# Altium schematic sheet Analog.SchDoc
size A4; SheetNumber: 3; SheetTotal: 3
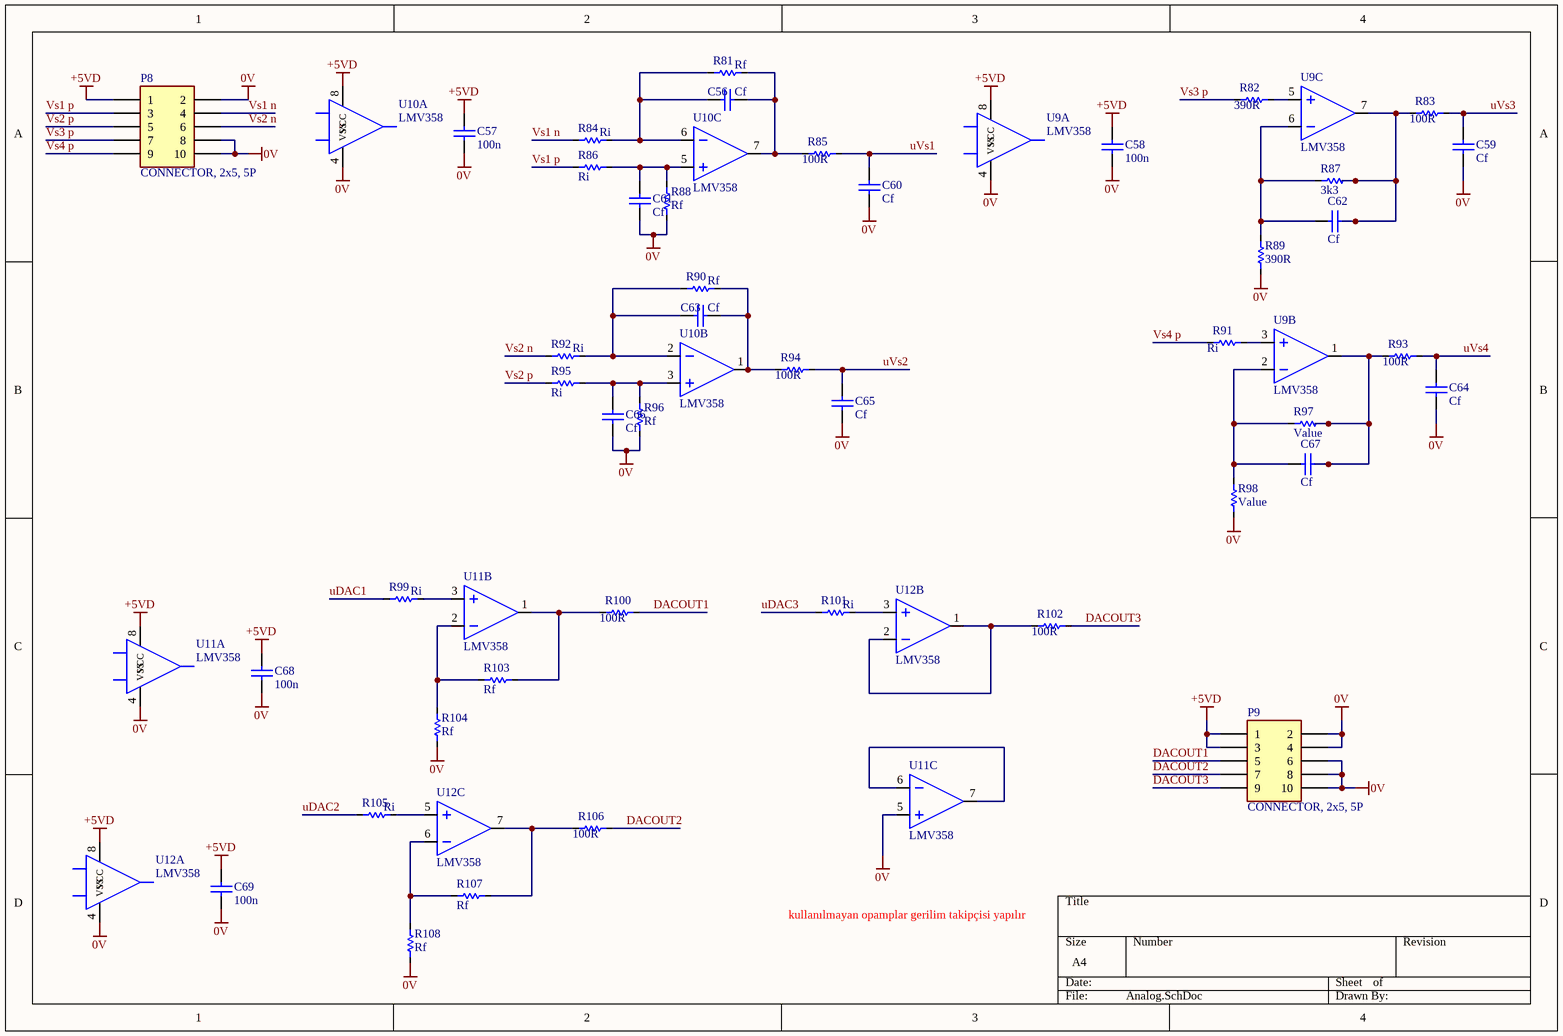
[diagram p0: Analog.SchDoc]

## Parts
C56  Cf  [CC3216-1206L]
C57  100n  [CC3216-1206L]
C58  100n  [CC3216-1206L]
C59  Cf  [CC3216-1206L]
C60  Cf  [CC3216-1206L]
C61  Cf  [CC3216-1206L]
C62  Cf  [CC3216-1206L]
C63  Cf  [CC3216-1206L]
C64  Cf  [CC3216-1206L]
C65  Cf  [CC3216-1206L]
C66  Cf  [CC3216-1206L]
C67  Cf  [CC3216-1206L]
C68  100n  [CC3216-1206L]
C69  100n  [CC3216-1206L]
P8  CONNECTOR, 2x5, 5P  [HDR_MALE_2X5_10P_2.54MM_180]
P9  CONNECTOR, 2x5, 5P  [HDR_MALE_2X5_10P_2.54MM_180]
R81  Rf  [CR3216-1206l]
R82  390R  [CR3216-1206l]
R83  100R  [CR3216-1206l]
R84  Ri  [CR3216-1206l]
R85  100R  [CR3216-1206l]
R86  Ri  [CR3216-1206l]
R87  3k3  [CR3216-1206l]
R88  Rf  [CR3216-1206l]
R89  390R  [CR3216-1206l]
R90  Rf  [CR3216-1206l]
R91  Ri  [CR3216-1206l]
R92  Ri  [CR3216-1206l]
R93  100R  [CR3216-1206l]
R94  100R  [CR3216-1206l]
R95  Ri  [CR3216-1206l]
R96  Rf  [CR3216-1206l]
R97  Value  [CR3216-1206l]
R98  Value  [CR3216-1206l]
R99  Ri  [CR3216-1206l]
R100  100R  [CR3216-1206l]
R101  Ri  [CR3216-1206l]
R102  100R  [CR3216-1206l]
R103  Rf  [CR3216-1206l]
R104  Rf  [CR3216-1206l]
R105  Ri  [CR3216-1206l]
R106  100R  [CR3216-1206l]
R107  Rf  [CR3216-1206l]
R108  Rf  [CR3216-1206l]
U9  LMV358  [SOIC127P600X175-8N]  (parts A,B,C of 3)
U10  LMV358  [SOIC127P600X175-8N]  (parts A,B,C of 3)
U11  LMV358  [SOIC127P600X175-8N]  (parts A,B,C of 3)
U12  LMV358  [SOIC127P600X175-8N]  (parts A,B,C of 3)

## Nets
0V: C57.2 C58.2 C59.1 C60.2 C61.2 C64.1 C65.2 C66.2 C68.2 C69.2 P8.2 P8.8 P8.10 P9.2 P9.4 P9.6 P9.8 P9.10 R88.1 R89.2 R96.1 R98.2 R104.1 R108.1 U9.4(VSS) U10.4(VSS) U11.4(VSS) U11.5 U12.4(VSS)
+5VD: C57.1 C58.1 C68.1 C69.1 P8.1 P9.1 P9.3 U9.8(VCC) U10.8(VCC) U11.8(VCC) U12.8(VCC)
DACOUT1: P9.5 R100.2
DACOUT2: P9.7 R106.2
DACOUT3: P9.9 R102.2
uDAC1: R99.1
uDAC2: R105.1
uDAC3: R101.1
uVs1: C60.1 R85.2
uVs2: C65.1 R94.2
uVs3: C59.2 R83.2
uVs4: C64.2 R93.2
Vs1 n: P8.4 R84.1
Vs1 p: P8.3 R86.1
Vs2 n: P8.6 R92.1
Vs2 p: P8.5 R95.1
Vs3 p: P8.7 R82.1
Vs4 p: P8.9 R91.1
NetC56_1: C56.1 R81.1 R84.2 U10.6
NetC56_2: C56.2 R81.2 R85.1 U10.7
NetC61_1: C61.1 R86.2 R88.2 U10.5
NetC62_1: C62.1 R83.1 R87.1 U9.7
NetC62_2: C62.2 R87.2 R89.1 U9.6
NetC63_1: C63.1 R90.1 R92.2 U10.2
NetC63_2: C63.2 R90.2 R94.1 U10.1
NetC66_1: C66.1 R95.2 R96.2 U10.3
NetC67_1: C67.1 R93.1 R97.1 U9.1
NetC67_2: C67.2 R97.2 R98.1 U9.2
NetR82_2: R82.2 U9.5
NetR91_2: R91.2 U9.3
NetR99_2: R99.2 U11.3
NetR100_1: R100.1 R103.2 U11.1
NetR101_2: R101.2 U12.3
NetR102_1: R102.1 U12.1 U12.2
NetR103_1: R103.1 R104.2 U11.2
NetR105_2: R105.2 U12.5
NetR106_1: R106.1 R107.2 U12.7
NetR107_1: R107.1 R108.2 U12.6
NetU11_6: U11.6 U11.7

## Notes on the sheet
- kullanılmayan opamplar gerilim takipçisi yapılır

## Library data of the parts
C56-C69 = CAPACITOR NON-POL: Capacitor; Stock Code: *; Component Type: Capacitor
P8 P9 = CONNECTOR, 2x5, 10P: Stock Code: *; Component Type: Connector
R81-R108 = RESISTOR: Component Type: Resistor
U9-U12 = OPAMP2: Dual Opamp; Stock Code: *; Component Type: IC